# Altium project 12S ESC.PrjPcb
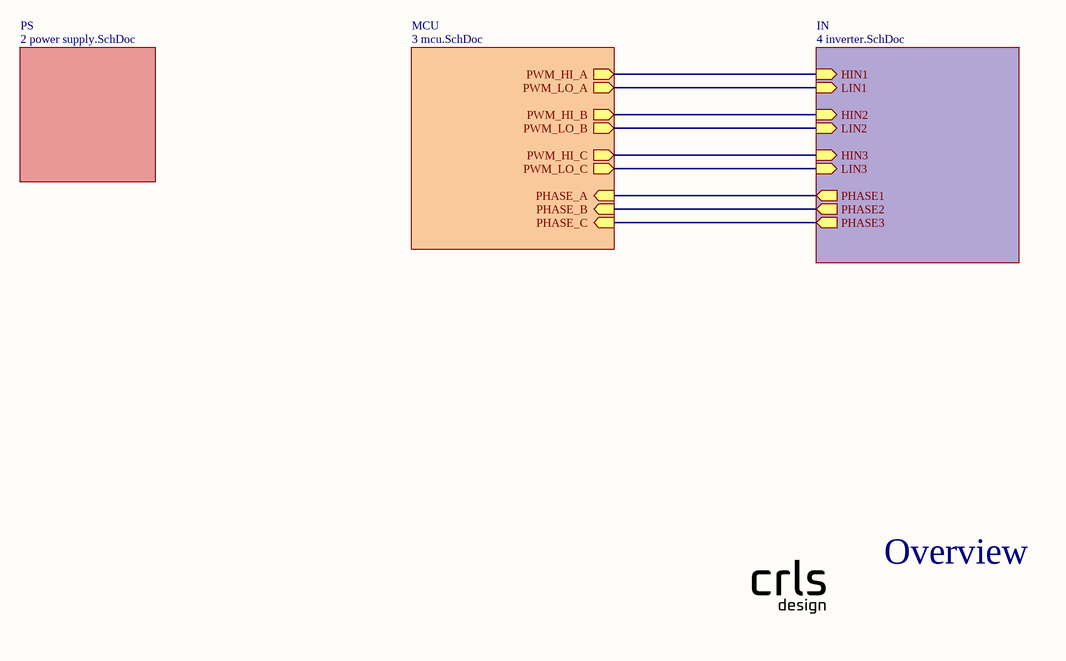
[diagram p0: 1 top.SchDoc]
6 sheets, 170 parts. Net scope: hierarchical (ports join the sheet entries above them; power ports are global).
Board files: main.PcbDoc, panel 1x1.PcbDoc, panel 1x2.PcbDoc
Sheets:
  1 top.SchDoc
    PS = 2 power supply.SchDoc
    MCU = 3 mcu.SchDoc
    IN = 4 inverter.SchDoc
      HB = 6 half bridge.SchDoc
      HB = 6 half bridge.SchDoc
      HB = 6 half bridge.SchDoc
      GD = 5 gate driver.SchDoc
      GD = 5 gate driver.SchDoc
      GD = 5 gate driver.SchDoc

## Sheet 1 top.SchDoc
size A4; SheetNumber: 1; SheetTotal: 6

### Sub-sheets
IN = 4 inverter.SchDoc: HIN1 (in), HIN2 (in), HIN3 (in), LIN1 (in), LIN2 (in), LIN3 (in), PHASE1 (out), PHASE2 (out), PHASE3 (out)
MCU = 3 mcu.SchDoc: PHASE_A (in), PHASE_B (in), PHASE_C (in), PWM_HI_A (out), PWM_LO_A (out), PWM_HI_B (out), PWM_LO_B (out), PWM_HI_C (out), PWM_LO_C (out)
PS = 2 power supply.SchDoc: no entries

### Nets
PHASE_A: sheet MCU/PHASE_A, sheet IN/PHASE1
PHASE_B: sheet MCU/PHASE_B, sheet IN/PHASE2
PHASE_C: sheet MCU/PHASE_C, sheet IN/PHASE3
PWM_HI_A: sheet MCU/PWM_HI_A, sheet IN/HIN1
PWM_HI_B: sheet MCU/PWM_HI_B, sheet IN/HIN2
PWM_HI_C: sheet MCU/PWM_HI_C, sheet IN/HIN3
PWM_LO_A: sheet MCU/PWM_LO_A, sheet IN/LIN1
PWM_LO_B: sheet MCU/PWM_LO_B, sheet IN/LIN2
PWM_LO_C: sheet MCU/PWM_LO_C, sheet IN/LIN3

### Notes on the sheet
- Overview

## Sheet 2 power supply.SchDoc
size A4; SheetNumber: 2; SheetTotal: 6
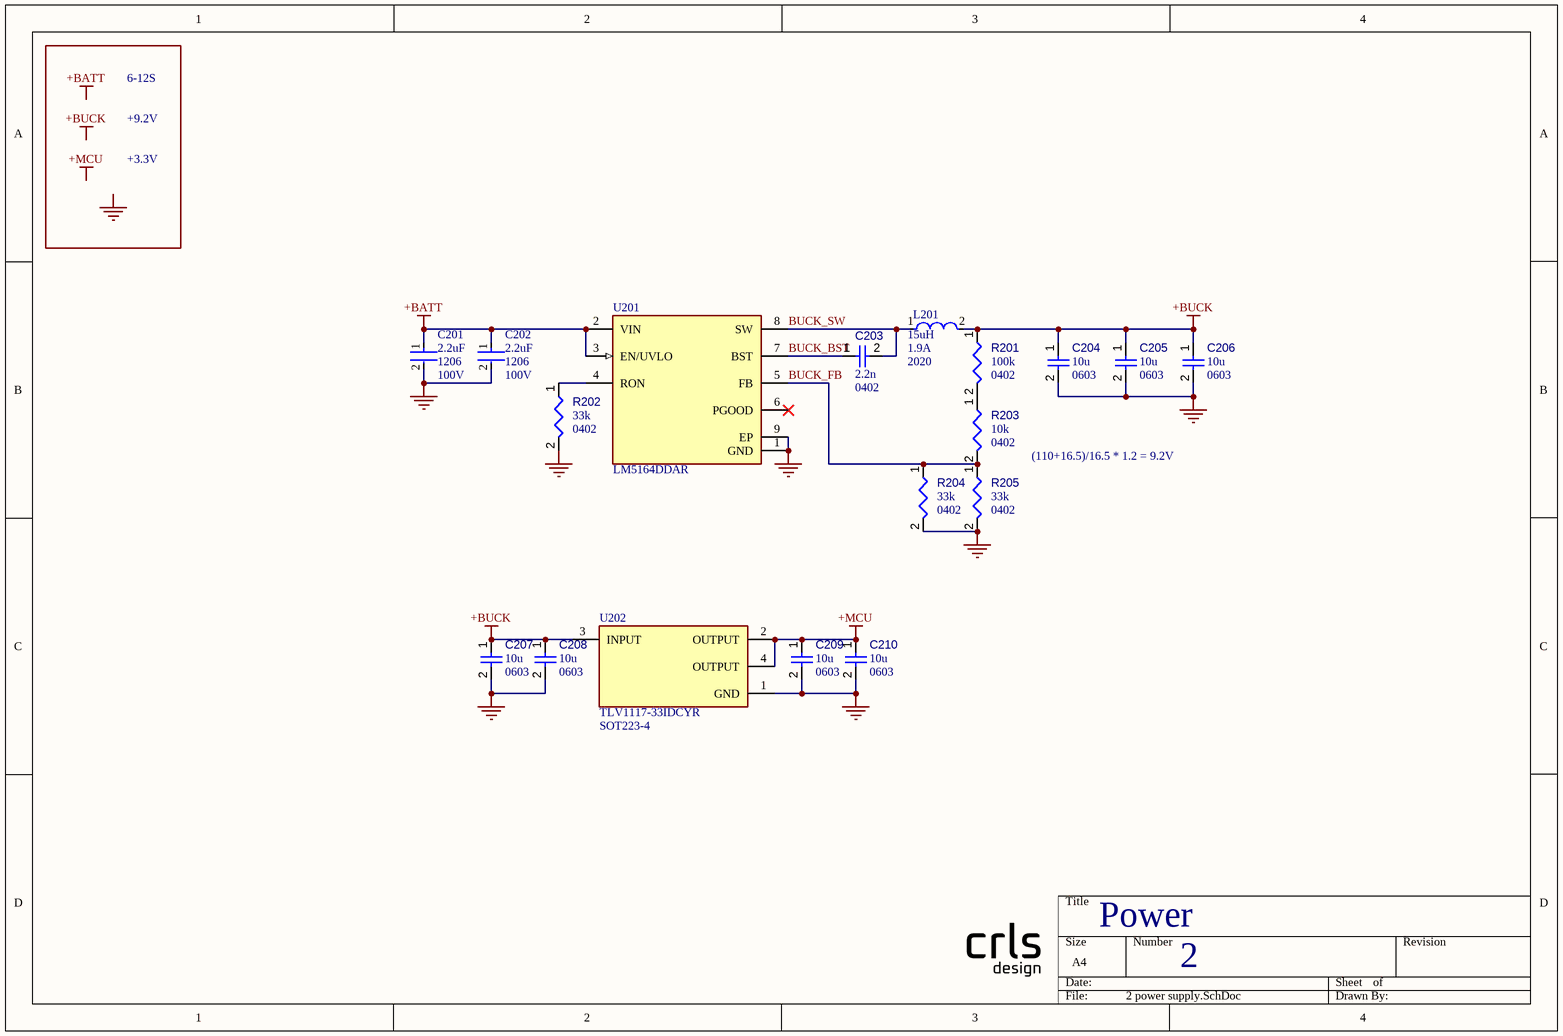
[diagram p1: 2 power supply.SchDoc]

### Parts
C201  Voltage Rating: 100V  Case/Package: 1206  Capacitance: 2.2uF  [FP-CC1206-0_3-1_9-MFG]  (hidden comment: CC1206KKX7R0BB225)
C202  Voltage Rating: 100V  Case/Package: 1206  Capacitance: 2.2uF  [FP-CC1206-0_3-1_9-MFG]  (hidden comment: CC1206KKX7R0BB225)
C203  value 2.2n  Case/Package: 0402  [CAPC0402(1005)60_L]  (hidden comment: Capacitors,ceramic,0402,10%,2.2n,50V)
C204  value 10u  Case/Package: 0603  [CAPC0603(1608)100_L]  (hidden comment: Capacitors,ceramic,0603,20%,10u,25V)
C205  value 10u  Case/Package: 0603  [CAPC0603(1608)100_L]  (hidden comment: Capacitors,ceramic,0603,20%,10u,25V)
C206  value 10u  Case/Package: 0603  [CAPC0603(1608)100_L]  (hidden comment: Capacitors,ceramic,0603,20%,10u,25V)
C207  value 10u  Case/Package: 0603  [CAPC0603(1608)100_L]  (hidden comment: Capacitors,ceramic,0603,20%,10u,25V)
C208  value 10u  Case/Package: 0603  [CAPC0603(1608)100_L]  (hidden comment: Capacitors,ceramic,0603,20%,10u,25V)
C209  value 10u  Case/Package: 0603  [CAPC0603(1608)100_L]  (hidden comment: Capacitors,ceramic,0603,20%,10u,25V)
C210  value 10u  Case/Package: 0603  [CAPC0603(1608)100_L]  (hidden comment: Capacitors,ceramic,0603,20%,10u,25V)
L201  Case/Package: 2020  Current Rating: 1.9A  Inductance: 15uH  [FP-IHLP-2020CZ-FP_1_905x2-MFG]  (hidden comment: IHLP2020CZER150M01)
R201  value 100k  Case/Package: 0402  [RESC0402(1005)_L]  (hidden comment: Resistors,0402,1%,100k)
R202  value 33k  Case/Package: 0402  [RESC0402(1005)_L]  (hidden comment: Resistors,0402,1%,33k)
R203  value 10k  Case/Package: 0402  [RESC0402(1005)_L]  (hidden comment: Resistors,0402,1%,10k)
R204  value 33k  Case/Package: 0402  [RESC0402(1005)_L]  (hidden comment: Resistors,0402,1%,33k)
R205  value 33k  Case/Package: 0402  [RESC0402(1005)_L]  (hidden comment: Resistors,0402,1%,33k)
U201  LM5164DDAR  [FP-DDA0008E-IPC_C]
U202  TLV1117-33IDCYR  Package: SOT223-4  [FP-DCY0004A-MFG]

### Nets
+BATT: C201.1 C202.1 U201.2(VIN) U201.3(EN/UVLO)
+BUCK: C204.1 C205.1 C206.1 C207.1 C208.1 L201.2 R201.1 U202.3(INPUT)
+MCU: C209.1 C210.1 U202.2(OUTPUT) U202.4(OUTPUT)
GND: C201.2 C202.2 C204.2 C205.2 C206.2 C207.2 C208.2 C209.2 C210.2 R202.2 R204.2 R205.2 U201.1(GND) U201.9(EP) U202.1(GND)
BUCK_BST: C203.1 U201.7(BST)
BUCK_FB: R203.2 R204.1 R205.1 U201.5(FB)
BUCK_SW: C203.2 L201.1 U201.8(SW)
NetR201_2: R201.2 R203.1
NetR202_1: R202.1 U201.4(RON)

Not connected (* = marked no-connect by the designer): U201 6(PGOOD)*

### Notes on the sheet
- 6-12S
- +9.2V
- +3.3V
- (110+16.5)/16.5 * 1.2 = 9.2V
- Power
- Labels drawn without touching a wire or pin: +BATT, +BUCK, +MCU, GND

### Library data of the parts
C201 C202 = CMP-03422-001455-1: CAP CER 2.2UF 100V X7R 1206; Tolerance: 10%; Mount: Surface Mount; Packaging: Tape and Reel; Length: 0.126inch; Max Operating Temperature: 125°C; Min Operating Temperature: -55°C; Width: 0.063inch; Thickness: 0.057inch
C203-C210 = Capacitors: Capacitor; Capacitor Type: ceramic; Component Type: Capacitors
  C203: Voltage Rating: 50V; Tolerance: 10%
  C204-C210: Voltage Rating: 25V; Tolerance: 20%
L201 = CMP-02424-000144-1: Fixed Inductors Commercial High Saturation Series 15uH 1.9A 265mΩ 20%; Test Frequency: 100kHz; DC Resistance (DCR): 265mR; Saturation Current: 2.5A; Core Material: Metal; Self Resonant Frequency: 5MHz; Shielding: Shielded; Height: 3mm; Max Operating Temperature: 125°C; Military Standard: Not; Package Quantity: 2000; Tolerance: 20%; Depth: 5.43mm; Packaging: Tape and Reel; Lead Free: Lead Free; Min Operating Temperature: -55°C; Radiation Hardening: No; Mount: Surface Mount; Height - Seated (Max): 0.118inch; Length: 5.49mm; Width: 0.204inch; Termination: SMD/SMT; Max DC Current: 2.5A
R201-R205 = Resistors: Resistor; Tolerance: 1%; Component Type: Resistors
U201 = CMP-04918-000011-1: POWER MANAGEMENT; Manufacturer: Texas Instruments; Standoff Height: 0mm; Max Supply Voltage: 100V; Output Voltage: 1.2-90V; Max Duty Cycle: 99%; Nominal Supply Current: 600uA; Output Current: 1A; Min Supply Voltage: 6V; Output Type: AdjustableProgrammable; Max Junction Temp: +150°C; Number Of Outputs: 1; Switching Frequency: 1000kHz; Switching Topology: Buck; Temperature: -40°C to +150°C; Device Class L1: Integrated Circuits (ICs); Automotive: No; Lead Free: Yes; Package: DDA0008E; Device Class L3: Voltage Regulators - Switching; Manufacturer Part Number: LM5164DDAR; Device Class L2: Power Management ICs; RoHS: TRUE; Mouser Description: 6-V to 100-V input, 1-A synchronous buck DC-DC converter with ultra-low IQ 8-SO PowerPAD -40 to 150; Temperature Range Low: -40°C; ComponentLink2Description: Datasheet; Temperature Range High: +150°C; ComponentLink2URL: http://www.ti.com/lit/ds/symlink/lm5164.pdf; Digikey Description: POWER MANAGEMENT; Category: IC; Octopart: https://octopart.com/lm5164ddar-texas+instruments-96785744
U202 = CMP-04917-000056-1: IC REG LIN 3.3V 800MA SOT223-4; Manufacturer: Texas Instruments; Nominal Supply Current: 5mA; Dropout Voltage: 1.2V; Max Supply Voltage: 15V; Min Supply Voltage: 4.7V; Output Type: Fixed; Number Of Outputs: 1; Output Current: 0.8A; Standoff Height: 0.02mm; Max Junction Temp: +125°C; Lead Free: Yes; RoHS: TRUE; Temperature: -40°C to +125°C; Device Class L1: Integrated Circuits (ICs); Output Voltage: 3.3V; Device Class L3: Voltage Regulators - Linear; Octopart: https://octopart.com/tlv1117-33idcyr-texas+instruments-669250; Device Class L2: Power Management ICs; Temperature Range High: +125°C; Category: IC; Height: 1.8mm; Automotive: No; Digikey Description: IC REG LIN 3.3V 800MA SOT223-4; Temperature Range Low: -40°C; ComponentLink2URL: http://www.ti.com/lit/ds/symlink/tlv1117.pdf; ComponentLink2Description: Datasheet; Manufacturer Part Number: TLV1117-33IDCYR; Mouser Description: LDO Voltage Regulators Fixed LDO Volt Reg

## Sheet 3 mcu.SchDoc
size A4; SheetNumber: 3; SheetTotal: 6
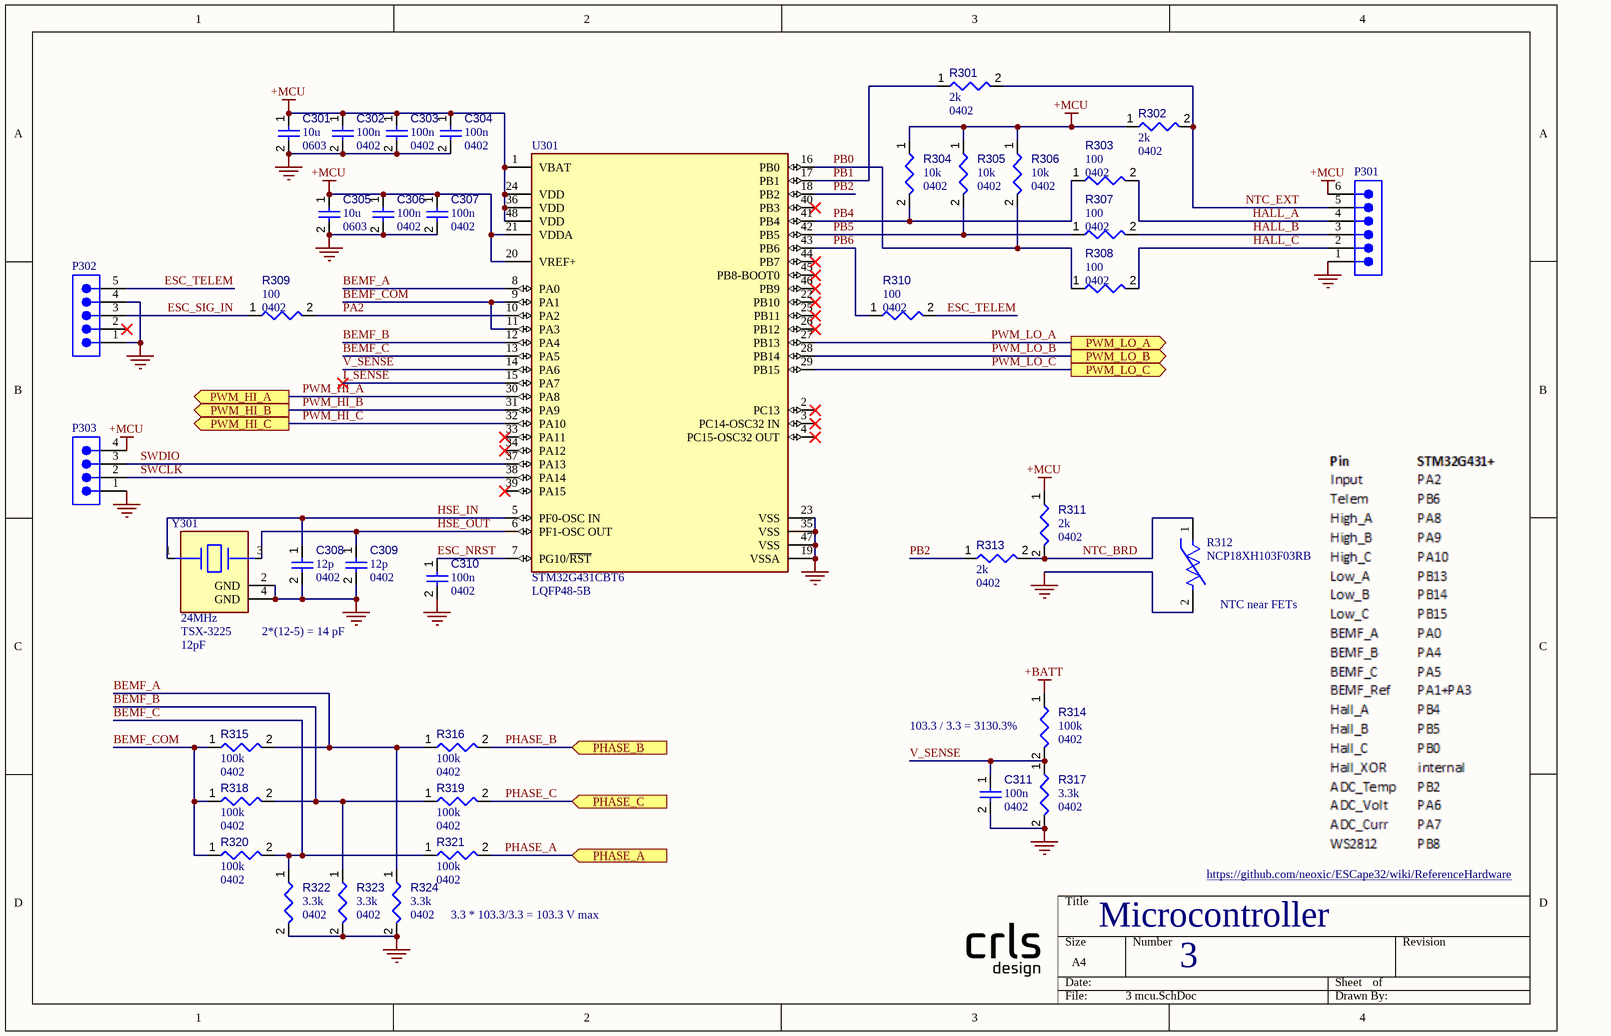
[diagram p2: 3 mcu.SchDoc]

### Parts
C301  value 10u  Case/Package: 0603  [CAPC0603(1608)100_L]  (hidden comment: Capacitors,ceramic,0603,20%,10u,25V)
C302  value 100n  Case/Package: 0402  [CAPC0402(1005)60_L]  (hidden comment: Capacitors,ceramic,0402,20%,100n,16V)
C303  value 100n  Case/Package: 0402  [CAPC0402(1005)60_L]  (hidden comment: Capacitors,ceramic,0402,20%,100n,16V)
C304  value 100n  Case/Package: 0402  [CAPC0402(1005)60_L]  (hidden comment: Capacitors,ceramic,0402,20%,100n,16V)
C305  value 10u  Case/Package: 0603  [CAPC0603(1608)100_L]  (hidden comment: Capacitors,ceramic,0603,20%,10u,25V)
C306  value 100n  Case/Package: 0402  [CAPC0402(1005)60_L]  (hidden comment: Capacitors,ceramic,0402,20%,100n,16V)
C307  value 100n  Case/Package: 0402  [CAPC0402(1005)60_L]  (hidden comment: Capacitors,ceramic,0402,20%,100n,16V)
C308  value 12p  Case/Package: 0402  [CAPC0402(1005)60_L]  (hidden comment: Capacitors,ceramic,0402,10%,12p,50V)
C309  value 12p  Case/Package: 0402  [CAPC0402(1005)60_L]  (hidden comment: Capacitors,ceramic,0402,10%,12p,50V)
C310  value 100n  Case/Package: 0402  [CAPC0402(1005)60_L]  (hidden comment: Capacitors,ceramic,0402,20%,100n,16V)
C311  value 100n  Case/Package: 0402  [CAPC0402(1005)60_L]  (hidden comment: Capacitors,ceramic,0402,20%,100n,16V)
P301  61300611121  [61300611121]  (value not drawn)
P302  61300511121  [61300511121]  (value not drawn)
P303  61300411121  [61300411121]  (value not drawn)
R301  value 2k  Case/Package: 0402  [RESC0402(1005)_L]  (hidden comment: Resistors,0402,1%,2k)
R302  value 2k  Case/Package: 0402  [RESC0402(1005)_L]  (hidden comment: Resistors,0402,1%,2k)
R303  value 100  Case/Package: 0402  [RESC0402(1005)_L]  (hidden comment: Resistors,0402,1%,100)
R304  value 10k  Case/Package: 0402  [RESC0402(1005)_L]  (hidden comment: Resistors,0402,1%,10k)
R305  value 10k  Case/Package: 0402  [RESC0402(1005)_L]  (hidden comment: Resistors,0402,1%,10k)
R306  value 10k  Case/Package: 0402  [RESC0402(1005)_L]  (hidden comment: Resistors,0402,1%,10k)
R307  value 100  Case/Package: 0402  [RESC0402(1005)_L]  (hidden comment: Resistors,0402,1%,100)
R308  value 100  Case/Package: 0402  [RESC0402(1005)_L]  (hidden comment: Resistors,0402,1%,100)
R309  value 100  Case/Package: 0402  [RESC0402(1005)_L]  (hidden comment: Resistors,0402,1%,100)
R310  value 100  Case/Package: 0402  [RESC0402(1005)_L]  (hidden comment: Resistors,0402,1%,100)
R311  value 2k  Case/Package: 0402  [RESC0402(1005)_L]  (hidden comment: Resistors,0402,1%,2k)
R312  NCP18XH103F03RB  [FP-NCP18-0_15-MFG]
R313  value 2k  Case/Package: 0402  [RESC0402(1005)_L]  (hidden comment: Resistors,0402,1%,2k)
R314  value 100k  Case/Package: 0402  [RESC0402(1005)_L]  (hidden comment: Resistors,0402,1%,100k)
R315  value 100k  Case/Package: 0402  [RESC0402(1005)_L]  (hidden comment: Resistors,0402,1%,100k)
R316  value 100k  Case/Package: 0402  [RESC0402(1005)_L]  (hidden comment: Resistors,0402,1%,100k)
R317  value 3.3k  Case/Package: 0402  [RESC0402(1005)_L]  (hidden comment: Resistors,0402,1%,3.3k)
R318  value 100k  Case/Package: 0402  [RESC0402(1005)_L]  (hidden comment: Resistors,0402,1%,100k)
R319  value 100k  Case/Package: 0402  [RESC0402(1005)_L]  (hidden comment: Resistors,0402,1%,100k)
R320  value 100k  Case/Package: 0402  [RESC0402(1005)_L]  (hidden comment: Resistors,0402,1%,100k)
R321  value 100k  Case/Package: 0402  [RESC0402(1005)_L]  (hidden comment: Resistors,0402,1%,100k)
R322  value 3.3k  Case/Package: 0402  [RESC0402(1005)_L]  (hidden comment: Resistors,0402,1%,3.3k)
R323  value 3.3k  Case/Package: 0402  [RESC0402(1005)_L]  (hidden comment: Resistors,0402,1%,3.3k)
R324  value 3.3k  Case/Package: 0402  [RESC0402(1005)_L]  (hidden comment: Resistors,0402,1%,3.3k)
U301  STM32G431CBT6  Package: LQFP48-5B  [FP-LQFP48-5B-MFG]
Y301  Frequency: 24MHz  Series: TSX-3225  [FP-TSX-3225-MFG]  (hidden comment: TSX-3225 24.0000MF20G-AC3)

### Ports
PHASE_A (in), PHASE_B (in), PHASE_C (in), PWM_HI_A (out), PWM_HI_B (out), PWM_HI_C (out), PWM_LO_A (out), PWM_LO_B (out), PWM_LO_C (out)

### Nets
+BATT: R314.1
+MCU: C301.1 C302.1 C303.1 C304.1 C305.1 C306.1 C307.1 P301.6 P303.4 R302.1 R304.1 R305.1 R306.1 R311.1 U301.1(VBAT) U301.20(VREF+) U301.21(VDDA) U301.24(VDD) U301.36(VDD) U301.48(VDD)
GND: C301.2 C302.2 C303.2 C304.2 C305.2 C306.2 C307.2 C308.2 C309.2 C310.2 C311.2 P301.1 P302.1 P302.4 P303.1 R312.2 R317.2 R322.2 R323.2 R324.2 U301.19(VSSA) U301.23(VSS) U301.35(VSS) U301.47(VSS) Y301.2(GND) Y301.4(GND)
BEMF_A: R315.2 R316.1 R324.1 U301.8(PA0)
BEMF_B: R318.2 R319.1 R323.1 U301.12(PA4)
BEMF_C: R320.2 R321.1 R322.1 U301.13(PA5)
BEMF_COM: R315.1 R318.1 R320.1 U301.9(PA1) U301.11(PA3)
ESC_NRST: C310.1 U301.7(PG10/~{RST})
ESC_SIG_IN: P302.3 R309.1
ESC_TELEM: P302.5 R310.2
HALL_A: P301.4 R303.2
HALL_B: P301.3 R307.2
HALL_C: P301.2 R308.2
HSE_IN: C308.1 U301.5(PF0-OSC_IN) Y301.1
HSE_OUT: C309.1 U301.6(PF1-OSC_OUT) Y301.3
I_SENSE: U301.15(PA7)
NTC_BRD: R311.2 R312.1 R313.2
NTC_EXT: P301.5 R301.2 R302.2
PA2: R309.2 U301.10(PA2)
PB0: R306.2 R308.1 U301.16(PB0)
PB1: R301.1 U301.17(PB1)
PB2: R313.1 U301.18(PB2)
PB4: R303.1 R304.2 U301.41(PB4)
PB5: R305.2 R307.1 U301.42(PB5)
PB6: R310.1 U301.43(PB6)
PHASE_A: R321.2 ; port PHASE_A
PHASE_B: R316.2 ; port PHASE_B
PHASE_C: R319.2 ; port PHASE_C
PWM_HI_A: U301.30(PA8) ; port PWM_HI_A
PWM_HI_B: U301.31(PA9) ; port PWM_HI_B
PWM_HI_C: U301.32(PA10) ; port PWM_HI_C
PWM_LO_A: U301.27(PB13) ; port PWM_LO_A
PWM_LO_B: U301.28(PB14) ; port PWM_LO_B
PWM_LO_C: U301.29(PB15) ; port PWM_LO_C
SWCLK: P303.2 U301.38(PA14)
SWDIO: P303.3 U301.37(PA13)
V_SENSE: C311.1 R314.2 R317.1 U301.14(PA6)

Not connected (* = marked no-connect by the designer): P302 2*; U301 2(PC13)* 3(PC14-OSC32_IN)* 4(PC15-OSC32_OUT)* 22(PB10)* 25(PB11)* 26(PB12)* 33(PA11)* 34(PA12)* 39(PA15)* 40(PB3)* 44(PB7)* 45(PB8-BOOT0)* 46(PB9)*

### Notes on the sheet
- (near Y301) 12pF
- (near Y301) 2*(12-5) = 14 pF
- (near R312) NTC near FETs
- (near R314) 103.3 / 3.3 = 3130.3%
- 3.3 * 103.3/3.3 = 103.3 V max
- https://github.com/neoxic/ESCape32/wiki/ReferenceHardware
- Microcontroller

### Library data of the parts
C301-C311 = Capacitors: Capacitor; Capacitor Type: ceramic; Component Type: Capacitors
  C301 C305: Voltage Rating: 25V; Tolerance: 20%
  C302-C304 C306 C307 C310 C311: Voltage Rating: 16V; Tolerance: 20%
  C308 C309: Voltage Rating: 50V; Tolerance: 10%
P301 = CMP-1502-01070-3: NexarPartId: 20084590; Current Rating: 3A; Pitch: 2.54mm; Gender: Male; Operating Supply Voltage: 250V; Connector Type: Male Pin; Number of Positions: 6; Contact Resistance: 20mΩ; Packaging: Bulk; Number of Pins: 6; Number of Rows: 1; Contact Plating: Gold; Lead Free: Lead Free; RoHS: Compliant; Contact Mating Length: 5.9944mm; Voltage Rating: 250V; REACH SVHC: Unknown; Contact Gender: Male; Housing Material: PBT; Min Operating Temperature: -40°C; Lead Pitch: 2.54mm; Mount: Through Hole; Number of Contacts: 6; Max Operating Temperature: 105°C; Contact Material: Copper; Orientation: Vertical; Termination: Through Hole; Color: Black; Height: 8.89mm
P302 = CMP-1502-01068-3: NexarPartId: 32855526; Connector Type: Male Pin; Gender: Male; Contact Resistance: 20mΩ; Pitch: 2.54mm; Operating Supply Voltage: 250V; Current Rating: 3A; Number of Contacts: 5; Lead Free: Lead Free; Color: Black; Packaging: Bulk; Lead Pitch: 2.54mm; Contact Material: Copper; Min Operating Temperature: -40°C; Contact Mating Length: 5.9944mm; Voltage Rating: 250V; Number of Pins: 5; Number of Positions: 5; Height: 8.89mm; Orientation: Vertical; REACH SVHC: Unknown; RoHS: Compliant; Contact Plating: Gold; Max Operating Temperature: 105°C; Mount: Through Hole; Number of Rows: 1; Termination: Solder
P303 = CMP-1502-01064-3: NexarPartId: 32855522; Operating Supply Voltage: 250V; Pitch: 2.54mm; Contact Resistance: 20mΩ; Number of Positions: 4; Current Rating: 3A; Connector Type: Male Pin; Gender: Male; Contact Plating: Gold; Height: 8.89mm; Lead Pitch: 2.54mm; Lead Free: Lead Free; Contact Mating Length: 5.9944mm; Number of Rows: 1; Termination: Solder; Packaging: Bulk; REACH SVHC: Unknown; Min Operating Temperature: -40°C; RoHS: Compliant; Number of Contacts: 4; Voltage Rating: 250V; Color: Black; Max Operating Temperature: 105°C; Contact Material: Copper; Mount: Through Hole; Orientation: Vertical; Number of Pins: 4
R301-R311 R313-R324 = Resistors: Resistor; Tolerance: 1%; Component Type: Resistors
R312 = CMP-2000-05271-3: NTC Thermistor for Temperature Sensor, 0603, 10kΩ, 1%, 0.1mA, 5V; Manufacturer Series: NCP18; Accuracy: 0.7%; Current Rating: 310uA; Max Power Dissipation: 100mW; Thermistor Application: TEMPERATURE COMPENSATION; Number of Terminals/Pins: 2; Resistance: 10kR; Case Code (Metric): 1608; RoHS Compliant: Yes; Max Operating Temperature: 125°C; Resistance Tolerance: 1%; Case/Package: 0603; Mount: Surface Mount; Lead Free: Lead Free; Min Operating Temperature: -40°C; REACH SVHC: No SVHC; Package Shape: Rectangular; Radiation Hardening: No; Series: NCP; Depth: 0.8mm; Number of Pins: 2; Length: 1.6mm; Height: 0.8mm; Terminal Placement: Dual; Tolerance: 1%; Case Code (Imperial): 0603; Terminal Finish: Tin; Power Rating: 100mW; Termination: SMD/SMT; Packaging: Tape and Reel; Package Quantity: 1
U301 = CMP-12105-000030-1: MAINSTREAM ARM CORTEX-M4+ MCU 17; Manufacturer: STMicroelectronics; Number Of Adc Channels: 17; Number Of I/Os: 38; Standoff Height: 0.05mm; Number Of Usb Channels: 1; Data Bus Width: 32bits; Number Of I2C Channels: 3; Number Of Pwm Channels: 31; Frequency: 170MHz; Memory Type: FLASH; Number Of Timers/Counters: 14; Ram Size: 32KBytes; Max Junction Temp: +105°C; Memory Size: 128KBytes; Min Supply Voltage: 1.62V; Max Supply Voltage: 3.6V; Number Of Uart Channels: 4; Interface: I2C,SPI,UART,USART,CAN,USB,LIN,IrDA,I2S; Temperature Range Low: -40°C; Lead Free: Yes; Device Class L3: Microcontrollers; Number Of Cores: 1; Temperature Range High: +85°C; Height: 1.6mm; Digikey Description: MAINSTREAM ARM CORTEX-M4+ MCU 17; Device Class L1: Integrated Circuits (ICs); RoHS: TRUE; Number Of A/D Converters: 1; Core Architecture: Arm Cortex-M4; Device Class L2: Embedded Processors and Controllers; ComponentLink2Description: Datasheet; Temperature: -40°C to +85°C; Ambient Temperature Range High: +85°C; Ambient Temperature Range Low: -40°C; Octopart: https://octopart.com/stm32g431cbt6-stmicroelectronics-98835224; ComponentLink2URL: https://www.st.com/resource/en/datasheet/stm32g431cb.pdf; Automotive: No; Number Of Spi Channels: 3; Manufacturer Part Number: STM32G431CBT6; Category: IC
Y301 = CMP-36405-000018-1: CRYSTAL 24.0000MHZ 9PF SMD; ESR (Equivalent Series Resistance): 40R; Frequency Stability: 20ppm; Tolerance: 10ppm; Drive Level: 200uW; Min Operating Temperature: -40°C; RoHS Compliant: Yes; Width: 2.5mm; Max Operating Temperature: 105°C; Package Quantity: 250; Load Capacitance: 9pF; Mount: Surface Mount; Lead Free: Lead Free; Height: 0.024inch; Depth: 2.5mm; Packaging: Tape and Reel; Weight: 0.000564oz; Number of Pins: 4; Termination: SMD/SMT; Case/Package: SMD/SMT; Length: 3.2mm; Frequency Tolerance: 10ppm

## Sheet 4 inverter.SchDoc
size A4; SheetNumber: 4; SheetTotal: 6
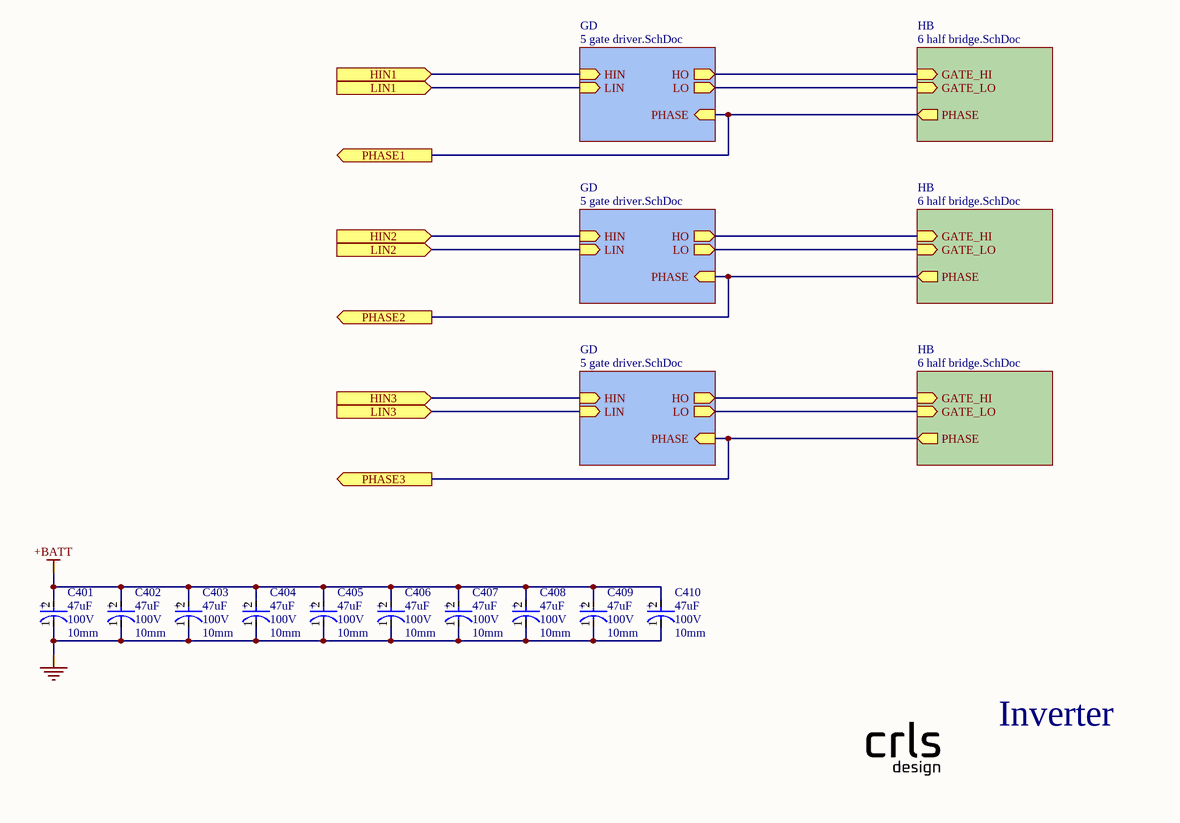
[diagram p3: 4 inverter.SchDoc]

### Parts
C401  Voltage Rating: 100V  Length: 10mm  Capacitance: 47uF  [FP-UUX2A470MNL1GS-MFG]  (hidden comment: UUX2A470MNL1GS)
C402  Voltage Rating: 100V  Length: 10mm  Capacitance: 47uF  [FP-UUX2A470MNL1GS-MFG]  (hidden comment: UUX2A470MNL1GS)
C403  Voltage Rating: 100V  Length: 10mm  Capacitance: 47uF  [FP-UUX2A470MNL1GS-MFG]  (hidden comment: UUX2A470MNL1GS)
C404  Voltage Rating: 100V  Length: 10mm  Capacitance: 47uF  [FP-UUX2A470MNL1GS-MFG]  (hidden comment: UUX2A470MNL1GS)
C405  Voltage Rating: 100V  Length: 10mm  Capacitance: 47uF  [FP-UUX2A470MNL1GS-MFG]  (hidden comment: UUX2A470MNL1GS)
C406  Voltage Rating: 100V  Length: 10mm  Capacitance: 47uF  [FP-UUX2A470MNL1GS-MFG]  (hidden comment: UUX2A470MNL1GS)
C407  Voltage Rating: 100V  Length: 10mm  Capacitance: 47uF  [FP-UUX2A470MNL1GS-MFG]  (hidden comment: UUX2A470MNL1GS)
C408  Voltage Rating: 100V  Length: 10mm  Capacitance: 47uF  [FP-UUX2A470MNL1GS-MFG]  (hidden comment: UUX2A470MNL1GS)
C409  Voltage Rating: 100V  Length: 10mm  Capacitance: 47uF  [FP-UUX2A470MNL1GS-MFG]  (hidden comment: UUX2A470MNL1GS)
C410  Voltage Rating: 100V  Length: 10mm  Capacitance: 47uF  [FP-UUX2A470MNL1GS-MFG]  (hidden comment: UUX2A470MNL1GS)

### Sub-sheets
GD = 5 gate driver.SchDoc: HIN (in), LIN (in), HO (out), LO (out), PHASE (in)
GD = 5 gate driver.SchDoc: HIN (in), LIN (in), HO (out), LO (out), PHASE (in)
GD = 5 gate driver.SchDoc: HIN (in), LIN (in), HO (out), LO (out), PHASE (in)
HB = 6 half bridge.SchDoc: GATE_HI (in), GATE_LO (in), PHASE (out)
HB = 6 half bridge.SchDoc: GATE_HI (in), GATE_LO (in), PHASE (out)
HB = 6 half bridge.SchDoc: GATE_HI (in), GATE_LO (in), PHASE (out)

### Ports
HIN1 (in), HIN2 (in), HIN3 (in), LIN1 (in), LIN2 (in), LIN3 (in), PHASE1 (out), PHASE2 (out), PHASE3 (out)

### Nets
+BATT: C401.2(A) C402.2(A) C403.2(A) C404.2(A) C405.2(A) C406.2(A) C407.2(A) C408.2(A) C409.2(A) C410.2(A)
GND: C401.1(C) C402.1(C) C403.1(C) C404.1(C) C405.1(C) C406.1(C) C407.1(C) C408.1(C) C409.1(C) C410.1(C)
HO: sheet HB/GATE_HI, sheet GD/HO
HO: sheet HB/GATE_HI, sheet GD/HO  [a separate net that carries the same name]
HO: sheet HB/GATE_HI, sheet GD/HO  [a separate net that carries the same name]
LO: sheet HB/GATE_LO, sheet GD/LO
LO: sheet HB/GATE_LO, sheet GD/LO  [a separate net that carries the same name]
LO: sheet HB/GATE_LO, sheet GD/LO  [a separate net that carries the same name]
PHASE_A: port PHASE1, sheet HB/PHASE, sheet GD/PHASE
PHASE_B: port PHASE2, sheet HB/PHASE, sheet GD/PHASE
PHASE_C: port PHASE3, sheet HB/PHASE, sheet GD/PHASE
PWM_HI_A: port HIN1, sheet GD/HIN
PWM_HI_B: port HIN2, sheet GD/HIN
PWM_HI_C: port HIN3, sheet GD/HIN
PWM_LO_A: port LIN1, sheet GD/LIN
PWM_LO_B: port LIN2, sheet GD/LIN
PWM_LO_C: port LIN3, sheet GD/LIN

### Notes on the sheet
- Inverter
- (in symbol CMP-2000-07372-2) +

### Library data of the parts
C401-C410 = CMP-2000-07372-2: CAP ALUM 47UF 20% 100V SMD; Life (Hours): 2000Hour; Ripple Current (AC): 230mA; Dissipation Factor: 0.08%; Leakage Current: 141uA; Lead Diameter: 1.1mm; Diameter: 10mm; Termination: SMD/SMT; Voltage: 100V; Tolerance: 20%; Packaging: Tape and Reel; Height - Seated (Max): 0.394inch; Case/Package: Radial; Features: General Purpose; Lead Pitch: 4.5mm; Height: 10mm; Min Operating Temperature: -55°C; REACH SVHC: No SVHC; Radiation Hardening: No; RoHS Compliant: Yes; Construction: Cylindrical; Package Quantity: 500; Voltage Rating (DC): 100V; Ripple Current: 230mA; Series: UX; Max Operating Temperature: 105°C; Mount: Surface Mount

## Sheet 6 half bridge.SchDoc
size A4; SheetNumber: 6; SheetTotal: 6
Used 3 times, as channels IN/HB, IN/HB, IN/HB. Parts and nets are listed once, with the designators drawn on the sheet.
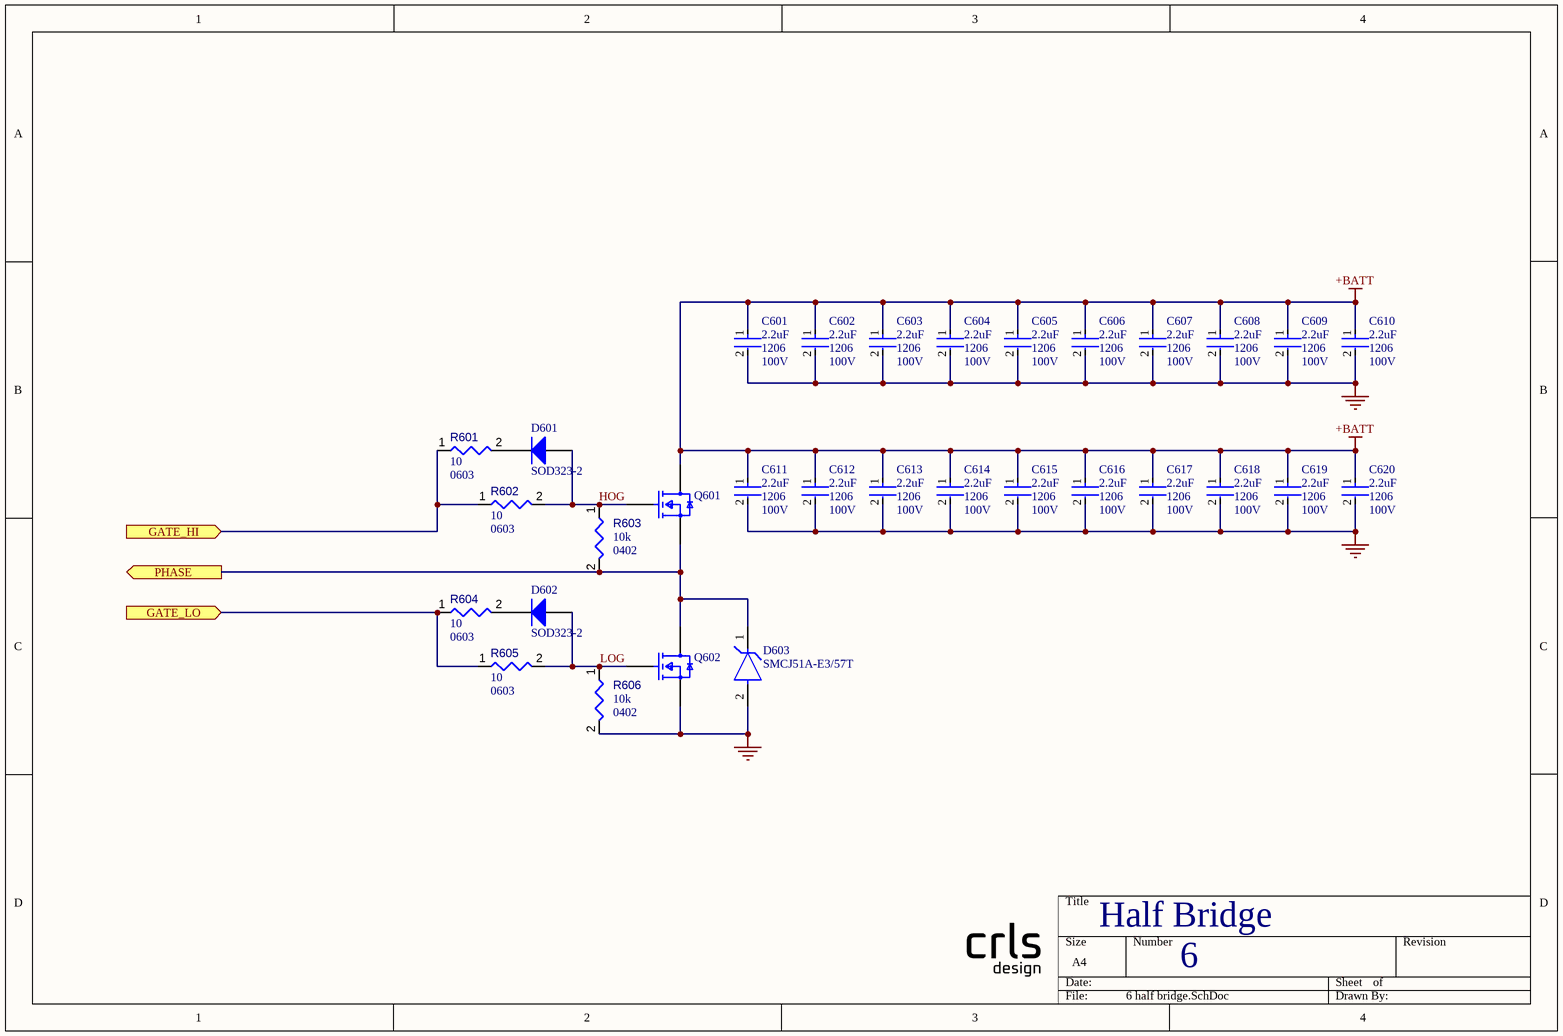
[diagram p4: 6 half bridge.SchDoc]

### Parts
C601  Voltage Rating: 100V  Case/Package: 1206  Capacitance: 2.2uF  [FP-CC1206-0_3-1_9-MFG]  (hidden comment: CC1206KKX7R0BB225)
C602  Voltage Rating: 100V  Case/Package: 1206  Capacitance: 2.2uF  [FP-CC1206-0_3-1_9-MFG]  (hidden comment: CC1206KKX7R0BB225)
C603  Voltage Rating: 100V  Case/Package: 1206  Capacitance: 2.2uF  [FP-CC1206-0_3-1_9-MFG]  (hidden comment: CC1206KKX7R0BB225)
C604  Voltage Rating: 100V  Case/Package: 1206  Capacitance: 2.2uF  [FP-CC1206-0_3-1_9-MFG]  (hidden comment: CC1206KKX7R0BB225)
C605  Voltage Rating: 100V  Case/Package: 1206  Capacitance: 2.2uF  [FP-CC1206-0_3-1_9-MFG]  (hidden comment: CC1206KKX7R0BB225)
C606  Voltage Rating: 100V  Case/Package: 1206  Capacitance: 2.2uF  [FP-CC1206-0_3-1_9-MFG]  (hidden comment: CC1206KKX7R0BB225)
C607  Voltage Rating: 100V  Case/Package: 1206  Capacitance: 2.2uF  [FP-CC1206-0_3-1_9-MFG]  (hidden comment: CC1206KKX7R0BB225)
C608  Voltage Rating: 100V  Case/Package: 1206  Capacitance: 2.2uF  [FP-CC1206-0_3-1_9-MFG]  (hidden comment: CC1206KKX7R0BB225)
C609  Voltage Rating: 100V  Case/Package: 1206  Capacitance: 2.2uF  [FP-CC1206-0_3-1_9-MFG]  (hidden comment: CC1206KKX7R0BB225)
C610  Voltage Rating: 100V  Case/Package: 1206  Capacitance: 2.2uF  [FP-CC1206-0_3-1_9-MFG]  (hidden comment: CC1206KKX7R0BB225)
C611  Voltage Rating: 100V  Case/Package: 1206  Capacitance: 2.2uF  [FP-CC1206-0_3-1_9-MFG]  (hidden comment: CC1206KKX7R0BB225)
C612  Voltage Rating: 100V  Case/Package: 1206  Capacitance: 2.2uF  [FP-CC1206-0_3-1_9-MFG]  (hidden comment: CC1206KKX7R0BB225)
C613  Voltage Rating: 100V  Case/Package: 1206  Capacitance: 2.2uF  [FP-CC1206-0_3-1_9-MFG]  (hidden comment: CC1206KKX7R0BB225)
C614  Voltage Rating: 100V  Case/Package: 1206  Capacitance: 2.2uF  [FP-CC1206-0_3-1_9-MFG]  (hidden comment: CC1206KKX7R0BB225)
C615  Voltage Rating: 100V  Case/Package: 1206  Capacitance: 2.2uF  [FP-CC1206-0_3-1_9-MFG]  (hidden comment: CC1206KKX7R0BB225)
C616  Voltage Rating: 100V  Case/Package: 1206  Capacitance: 2.2uF  [FP-CC1206-0_3-1_9-MFG]  (hidden comment: CC1206KKX7R0BB225)
C617  Voltage Rating: 100V  Case/Package: 1206  Capacitance: 2.2uF  [FP-CC1206-0_3-1_9-MFG]  (hidden comment: CC1206KKX7R0BB225)
C618  Voltage Rating: 100V  Case/Package: 1206  Capacitance: 2.2uF  [FP-CC1206-0_3-1_9-MFG]  (hidden comment: CC1206KKX7R0BB225)
C619  Voltage Rating: 100V  Case/Package: 1206  Capacitance: 2.2uF  [FP-CC1206-0_3-1_9-MFG]  (hidden comment: CC1206KKX7R0BB225)
C620  Voltage Rating: 100V  Case/Package: 1206  Capacitance: 2.2uF  [FP-CC1206-0_3-1_9-MFG]  (hidden comment: CC1206KKX7R0BB225)
D601  PackageReference: SOD323-2  [DIOD-SOD323-2-A_V]  (hidden comment: 1N4148WS-7-F)
D602  PackageReference: SOD323-2  [DIOD-SOD323-2-A_V]  (hidden comment: 1N4148WS-7-F)
D603  SMCJ51A-E3/57T  [FP-95402-MFG]
Q601  IAUT300N10S5N015ATMA1  [FP-PG-HSOF-8-MFG]  (value not drawn)
Q602  IAUT300N10S5N015ATMA1  [FP-PG-HSOF-8-MFG]  (value not drawn)
R601  value 10  Case/Package: 0603  [RESC0603(1608)_L]  (hidden comment: Resistors,0603,1%,10)
R602  value 10  Case/Package: 0603  [RESC0603(1608)_L]  (hidden comment: Resistors,0603,1%,10)
R603  value 10k  Case/Package: 0402  [RESC0402(1005)_L]  (hidden comment: Resistors,0402,1%,10k)
R604  value 10  Case/Package: 0603  [RESC0603(1608)_L]  (hidden comment: Resistors,0603,1%,10)
R605  value 10  Case/Package: 0603  [RESC0603(1608)_L]  (hidden comment: Resistors,0603,1%,10)
R606  value 10k  Case/Package: 0402  [RESC0402(1005)_L]  (hidden comment: Resistors,0402,1%,10k)

### Ports
GATE_HI (in), GATE_LO (in), PHASE (out)

### Nets
+BATT: C601.1 C602.1 C603.1 C604.1 C605.1 C606.1 C607.1 C608.1 C609.1 C610.1 C611.1 C612.1 C613.1 C614.1 C615.1 C616.1 C617.1 C618.1 C619.1 C620.1 Q601.9(DRAIN)
GND: C601.2 C602.2 C603.2 C604.2 C605.2 C606.2 C607.2 C608.2 C609.2 C610.2 C611.2 C612.2 C613.2 C614.2 C615.2 C616.2 C617.2 C618.2 C619.2 C620.2 D603.2(A) Q602.2-3-4-5-6-7-8(SOURCE) R606.2
GATE_HI: R601.1 R602.1 ; port GATE_HI
GATE_LO: R604.1 R605.1 ; port GATE_LO
HOG: D601.1(A) Q601.1(GATE) R602.2 R603.1
LOG: D602.1(A) Q602.1(GATE) R605.2 R606.1
PHASE: D603.1(C) Q601.2-3-4-5-6-7-8(SOURCE) Q602.9(DRAIN) R603.2 ; port PHASE
NetD601_2: D601.2(K) R601.2
NetD602_2: D602.2(K) R604.2

### Channels
IN/HB: designators end in _IN_HB#1; ports GATE_HI=HO GATE_LO=LO PHASE=PHASE_A
IN/HB: designators end in _IN_HB#2; ports GATE_HI=HO GATE_LO=LO PHASE=PHASE_B
IN/HB: designators end in _IN_HB#3; ports GATE_HI=HO GATE_LO=LO PHASE=PHASE_C

### Notes on the sheet
- Half Bridge

### Library data of the parts
C601-C620 = CMP-03422-001455-1: as C201 on sheet 2 power supply; Mount: Surface Mount; Packaging: Tape and Reel; Length: 0.126inch; Max Operating Temperature: 125°C; Min Operating Temperature: -55°C; Width: 0.063inch; Thickness: 0.057inch
D601 D602 = CMP-1667-00004-1: Fast Switching Diode, 75 V, 0.3 A, -65 to 150 degC, 2-Pin SOD323, RoHS, Tape and Reel; DatasheetVersion: Rev. 25-2, 03/2016; PackageDescription: 2-Pin Small Outline Diode, Body 1.7 x 1.3 mm; ComponentLink2Description: Datasheet; ComponentLink1URL: http://www.diodes.com/; ComponentLink2URL: http://www.diodes.com/datasheets/ds30097.pdf; ComponentLink1Description: Manufacturer URL
D603 = CMP-02577-000006-1: TVS DIODE 51V 82.4V DO214AB; Manufacturer: Vishay; Peak Pulse Power: 1500W; Breakdown Voltage: 56.7V; Standoff Height: 0mm; Direction: Unidirectional; Max Junction Temp: +150°C; Peak Pulse Current: 18.2A; Number Of Channels: 1; Temperature Range High: +150°C; Category: Diode; Temperature: -55°C to +150°C; Octopart: https://octopart.com/smcj51a-e3%2F57t-vishay-39559249; Device Class L3: unset; Mouser Description: TVS Diodes - Transient Voltage Suppressors 1500W 51V Unidirect; Digikey Description: TVS DIODE 51V 82.4V DO214AB; RoHS: TRUE; Height: 2.62mm; Reverse Standoff Voltage: 51V; Lead Free: Yes; Manufacturer Part Number: SMCJ51A-E3/57T; Clamping Voltage: 82.4V; Package: 95402; ComponentLink2URL: https://www.vishay.com/docs/88394/smcj.pdf; Device Class L1: Circuit Protection; Footprint Url: https://www.vishay.com/docs/95402/smc.pdf; Device Class L2: TVS Diodes; ComponentLink2Description: Datasheet; Automotive: No; Temperature Range Low: -55°C
Q601 Q602 = CMP-32901-000024-1: 100V 300A 1.5MOHM TOLL; Manufacturer: Infineon; Number Of Channels: 1; Power Dissipation: 375W; Automotive Grade: Grade 0; Turn Off Delay Time: 70ns; Input Capacitace At Vds: 12316pF @ 50V; Turn On Delay Time: 29ns; Max Junction Temp: +175°C; Max Forward Diode Voltage: 1.3V; Depletion Mode: False; Gate Charge At Vgs: 166nC @ 10V; Gate To Source Voltage: 20V; Typ Forward Diode Voltage: 0.9V; Reverse Recovery Charge: 220nC; Threshold Vgs Min: 2.2V; Pulse Drain Current: 1200A; Threshold Vgs Max: 3.8V; Drain To Source Resistance: 1.3mΩ; Reverse Recovery Time: 90ns; Drain To Source Voltage: 100V; Package: PG-HSOF-8; Lead Free: Yes; Temperature Range Low: -55°C; ComponentLink2URL: https://www.infineon.com/dgdl/Infineon-IAUT300N10S5N015-DS-v01_00-EN.pdf?fileId=5546d4625ee5d4cd015f2469d7203245; Category: Trans; Automotive: Yes; ComponentLink2Description: Datasheet; Height: 2.4mm; Device Class L1: Discrete Semiconductors; Temperature: -55°C to +175°C; Temperature Range High: +175°C; Number Of N Channels: 1; Digikey Description: 100V 300A 1.5MOHM TOLL; Drain To Source Breakdown Voltage: 100V; Octopart: https://octopart.com/iaut300n10s5n015atma1-infineon-88797377; Device Class L3: MOSFETs; Footprint Url: https://www.infineon.com/cms/en/product/packages/PG-HSOF/PG-HSOF-8-1/; Manufacturer Part Number: IAUT300N10S5N015ATMA1; Continuous Drain Current: 300A; RoHS: TRUE; Device Class L2: Transistors
R601-R606 = Resistors: Resistor; Tolerance: 1%; Component Type: Resistors

## Sheet 5 gate driver.SchDoc
size A4; SheetNumber: 5; SheetTotal: 6
Used 3 times, as channels IN/GD, IN/GD, IN/GD. Parts and nets are listed once, with the designators drawn on the sheet.
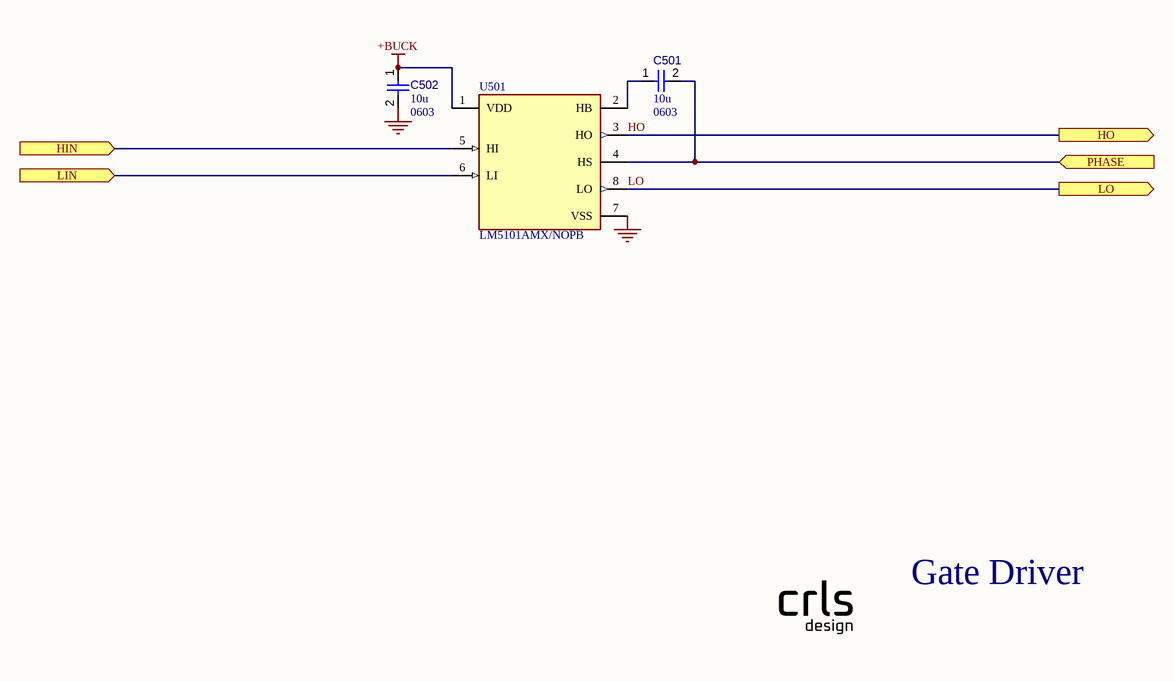
[diagram p5: 5 gate driver.SchDoc]

### Parts
C501  value 10u  Case/Package: 0603  [CAPC0603(1608)100_L]  (hidden comment: Capacitors,ceramic,0603,20%,10u,25V)
C502  value 10u  Case/Package: 0603  [CAPC0603(1608)100_L]  (hidden comment: Capacitors,ceramic,0603,20%,10u,25V)
U501  LM5101AMX/NOPB  [FP-D0008A-MFG]

### Ports
HIN (in), HO (out), LIN (in), LO (out), PHASE (in)

### Nets
+BUCK: C502.1 U501.1(VDD)
GND: C502.2 U501.7(VSS)
HIN: U501.5(HI) ; port HIN
HO: U501.3(HO) ; port HO
LIN: U501.6(LI) ; port LIN
LO: U501.8(LO) ; port LO
PHASE: C501.2 U501.4(HS) ; port PHASE
NetC501_1: C501.1 U501.2(HB)

### Channels
IN/GD: designators end in _IN_GD#1; ports HIN=PWM_HI_A HO=HO LIN=PWM_LO_A LO=LO PHASE=PHASE_A
IN/GD: designators end in _IN_GD#2; ports HIN=PWM_HI_B HO=HO LIN=PWM_LO_B LO=LO PHASE=PHASE_B
IN/GD: designators end in _IN_GD#3; ports HIN=PWM_HI_C HO=HO LIN=PWM_LO_C LO=LO PHASE=PHASE_C

### Notes on the sheet
- Gate Driver

### Library data of the parts
C501 C502 = Capacitors: Capacitor; Capacitor Type: ceramic; Voltage Rating: 25V; Tolerance: 20%; Component Type: Capacitors
U501 = CMP-04912-000094-1: IC GATE DRVR HALF-BRIDGE 8SOIC; Supply Current: 2mA; Number of Channels: 2; Turn-Off Delay Time: 4ns; Min Supply Voltage: 9V; Max Supply Voltage: 14V; Rise Time: 430ns; Propagation Delay: 26ns; Max Output Current: 3A; Quiescent Current: 200uA; Fall Time: 260ns; Series: LM5101A; Number of Outputs: 2; Mount: Surface Mount; RoHS Compliant: Yes; Nominal Supply Current: 2mA; Case/Package: SOIC; Number of Pins: 8; Number of Drivers: 2; Lead Free: Lead Free; Max Operating Temperature: 125°C; Output Current: 3A; Package Quantity: 2500; Radiation Hardening: No; Min Operating Temperature: -40°C; Packaging: Tape and Reel; Turn-On Delay Time: 4ns

## Nets that join several sheets
+BATT: 2 power supply (C201.1 C202.1 U201.2 U201.3), 3 mcu (R314.1), 4 inverter (10 pins), IN/HB (21 pins), IN/HB (21 pins), IN/HB (21 pins)
+BUCK: 2 power supply (8 pins), IN/GD (C502_IN_GD#1.1 U501_IN_GD#1.1), IN/GD (C502_IN_GD#2.1 U501_IN_GD#2.1), IN/GD (C502_IN_GD#3.1 U501_IN_GD#3.1)
+MCU: 2 power supply (C209.1 C210.1 U202.2 U202.4), 3 mcu (20 pins)
GND: 2 power supply (15 pins), 3 mcu (26 pins), 4 inverter (10 pins), IN/HB (23 pins), IN/HB (23 pins), IN/HB (23 pins), IN/GD (C502_IN_GD#1.2 U501_IN_GD#1.7), IN/GD (C502_IN_GD#2.2 U501_IN_GD#2.7), IN/GD (C502_IN_GD#3.2 U501_IN_GD#3.7)
HO: IN/HB (R601_IN_HB#1.1 R602_IN_HB#1.1), IN/GD (U501_IN_GD#1.3)
HO: IN/HB (R601_IN_HB#2.1 R602_IN_HB#2.1), IN/GD (U501_IN_GD#2.3)
HO: IN/HB (R601_IN_HB#3.1 R602_IN_HB#3.1), IN/GD (U501_IN_GD#3.3)
LO: IN/HB (R604_IN_HB#1.1 R605_IN_HB#1.1), IN/GD (U501_IN_GD#1.8)
LO: IN/HB (R604_IN_HB#2.1 R605_IN_HB#2.1), IN/GD (U501_IN_GD#2.8)
LO: IN/HB (R604_IN_HB#3.1 R605_IN_HB#3.1), IN/GD (U501_IN_GD#3.8)
PHASE_A: 3 mcu (R321.2), IN/HB (D603_IN_HB#1.1 Q601_IN_HB#1.2-3-4-5-6-7-8 Q602_IN_HB#1.9 R603_IN_HB#1.2), IN/GD (C501_IN_GD#1.2 U501_IN_GD#1.4)
PHASE_B: 3 mcu (R316.2), IN/HB (D603_IN_HB#2.1 Q601_IN_HB#2.2-3-4-5-6-7-8 Q602_IN_HB#2.9 R603_IN_HB#2.2), IN/GD (C501_IN_GD#2.2 U501_IN_GD#2.4)
PHASE_C: 3 mcu (R319.2), IN/HB (D603_IN_HB#3.1 Q601_IN_HB#3.2-3-4-5-6-7-8 Q602_IN_HB#3.9 R603_IN_HB#3.2), IN/GD (C501_IN_GD#3.2 U501_IN_GD#3.4)
PWM_HI_A: 3 mcu (U301.30), IN/GD (U501_IN_GD#1.5)
PWM_HI_B: 3 mcu (U301.31), IN/GD (U501_IN_GD#2.5)
PWM_HI_C: 3 mcu (U301.32), IN/GD (U501_IN_GD#3.5)
PWM_LO_A: 3 mcu (U301.27), IN/GD (U501_IN_GD#1.6)
PWM_LO_B: 3 mcu (U301.28), IN/GD (U501_IN_GD#2.6)
PWM_LO_C: 3 mcu (U301.29), IN/GD (U501_IN_GD#3.6)